# Altium project ADV7611采集卡.PrjPcb
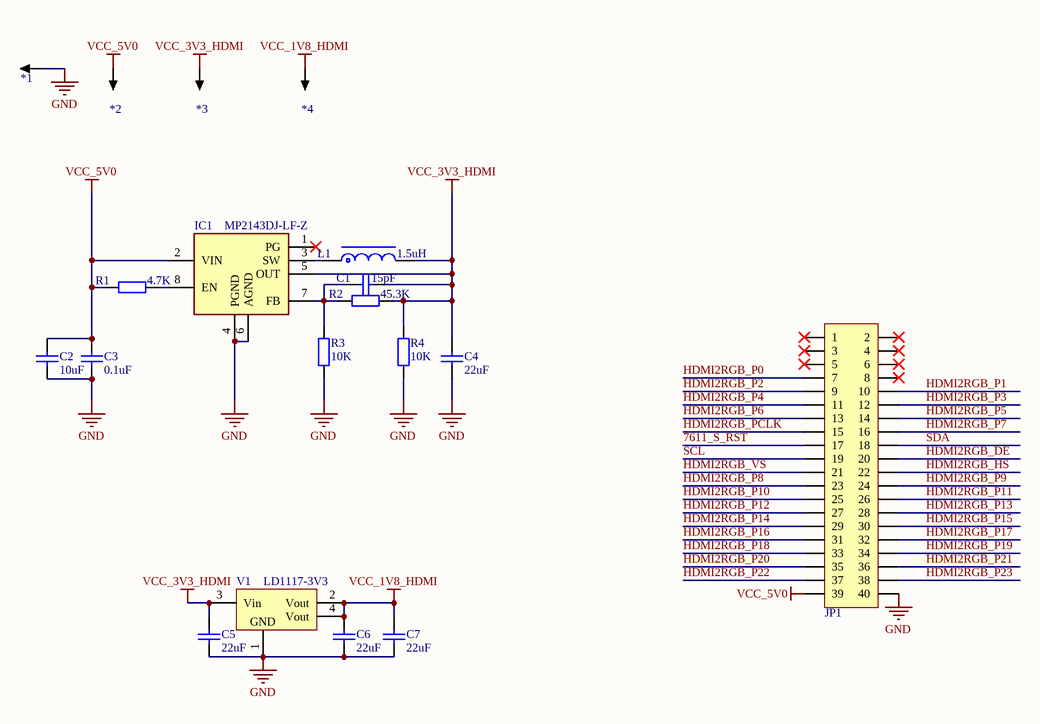
[diagram p0: HAT.SchDoc]
2 sheets, 57 parts. Net scope: global (net labels, ports and power ports of the same name join across sheets).
Board file: ADV7611采集卡.PcbDoc
Sheets:
  HAT.SchDoc
  ADV7611.SchDoc

## Sheet HAT.SchDoc
size A4; DocumentNumber: 2; SheetNumber: 1; SheetTotal: 2

### Parts
*1  CS  [R100]  (value not drawn)
*2  CS  [R100]  (value not drawn)
*3  CS  [R100]  (value not drawn)
*4  CS  [R100]  (value not drawn)
C1  15pF  [C0402_L]
C2  10uF  [C0805_L]
C3  0.1uF  [C0402_L]
C4  22uF  [C0805_L]
C5  22uF  [C0603_L]
C6  22uF  [C0603_L]
C7  22uF  [C0805_L]
IC1  MP2143DJ-LF-Z  [SOP65P280X100-8N]
JP1  Header 2X11  [PHD2.0-LI-2x20P]  (value not drawn)
L1  1.5uH  [NR3010]
R1  4.7K  [R0402_L]
R2  45.3K  [R0402_L]
R3  10K  [R0402_L]
R4  10K  [R0402_L]
V1  LD1117-3V3  [SOT223_L]

### Nets
GND: *1.1 C2.1 C3.1 C4.1 C5.1 C6.1 C7.1 IC1.4(PGND) IC1.6(AGND) JP1.40 R3.1 R4.1 V1.1(GND)
VCC_1V8_HDMI: *4.1 C6.2 C7.2 V1.2(Vout) V1.4(Vout)
VCC_3V3_HDMI: *3.1 C1.1 C4.2 C5.2 IC1.5(OUT) L1.2 R2.1 R4.2 V1.3(Vin)
VCC_5V0: *2.1 C2.2 C3.2 IC1.2(VIN) JP1.39 R1.2
7611_S_RST: JP1.17
HDMI2RGB_DE: JP1.20
HDMI2RGB_HS: JP1.22
HDMI2RGB_P0: JP1.7
HDMI2RGB_P1: JP1.10
HDMI2RGB_P2: JP1.9
HDMI2RGB_P3: JP1.12
HDMI2RGB_P4: JP1.11
HDMI2RGB_P5: JP1.14
HDMI2RGB_P6: JP1.13
HDMI2RGB_P7: JP1.16
HDMI2RGB_P8: JP1.23
HDMI2RGB_P9: JP1.24
HDMI2RGB_P10: JP1.25
HDMI2RGB_P11: JP1.26
HDMI2RGB_P12: JP1.27
HDMI2RGB_P13: JP1.28
HDMI2RGB_P14: JP1.29
HDMI2RGB_P15: JP1.30
HDMI2RGB_P16: JP1.31
HDMI2RGB_P17: JP1.32
HDMI2RGB_P18: JP1.33
HDMI2RGB_P19: JP1.34
HDMI2RGB_P20: JP1.35
HDMI2RGB_P21: JP1.36
HDMI2RGB_P22: JP1.37
HDMI2RGB_P23: JP1.38
HDMI2RGB_PCLK: JP1.15
HDMI2RGB_VS: JP1.21
SCL: JP1.19
SDA: JP1.18
NetC1_2: C1.2 IC1.7(FB) R2.2 R3.2
NetIC1_3: IC1.3(SW) L1.1
NetIC1_8: IC1.8(EN) R1.1

Not connected (* = marked no-connect by the designer): IC1 1(PG)*; JP1 1* 2* 3* 4* 5* 6* 8*

### Library data of the parts
*1-*4 = CS: 探针焊盘; 联系卖家，免费查找封装: 唯一出售店铺网址https://shop463601444.taobao.com; BOM名称: 探针焊盘
C1-C7 = C: 贴片电容; BOM名称: 无极性贴片电容; 联系卖家，免费查找封装: 唯一出售店铺网址https://shop463601444.taobao.com
IC1 = MP2143DJ-LF-Z: Integrated Circuit; Manufacturer_Name: Monolithic Power Systems (MPS); Datasheet Link: https://www.mouser.com/ds/2/277/MP2143_r1.07-371732.pdf; Height: 1mm; Manufacturer_Part_Number: MP2143DJ-LF-Z; Mouser Part Number: 946-MP2143DJLFZ; Mouser Price/Stock: https://www.mouser.co.uk/ProductDetail/Monolithic-Power-Systems-MPS/MP2143DJ-LF-Z?qs=QEkzKklKf2Sh6e0cSbvEyA%3D%3D
JP1 = Header 20X2: 20*2P接插件; 封装库来自淘宝卖家 ID：黄晶宝石: 其他店铺购入均为盗版假冒封装库; BOM名称: 20*2P接插件
L1 = L-NR: 太诱-NR磁胶电感; 0.0_BOM名称: NR磁胶电感; 3.交流分享: Q群514746572,开源更新,欢迎一起交流学习PCB设计; 4.作者声明: 旨为整合最全库集,欢迎转载,禁止商用！-冰凌猫; 5.备注说明: 该库已二次整合过网上各热销库,基本最全,无需重复搜购安装; 1.库作者: 冰凌猫; 2.库版本: v2.0 (2021.03.30)
R1-R4 = R: 贴片电阻; 联系卖家，免费查找封装: 唯一出售店铺网址https://shop463601444.taobao.com; 封装库来自淘宝卖家ID：黄晶宝石: 其他店铺购入均为盗版假冒封装库，请立即申请退款; BOM名称: 贴片电阻
V1 = LD1117: 三端稳压芯片; BOM名称: 稳压芯片; 封装库来自淘宝卖家 ID：黄晶宝石: 其他店铺购入均为盗版，请立即申请退款，本店现金奖励5~20元; 联系卖家 免费查找封装: 唯一出售店铺网址https://shop463601444.taobao.com

## Sheet ADV7611.SchDoc
size A4; DocumentNumber: 2; SheetNumber: 2; SheetTotal: 2
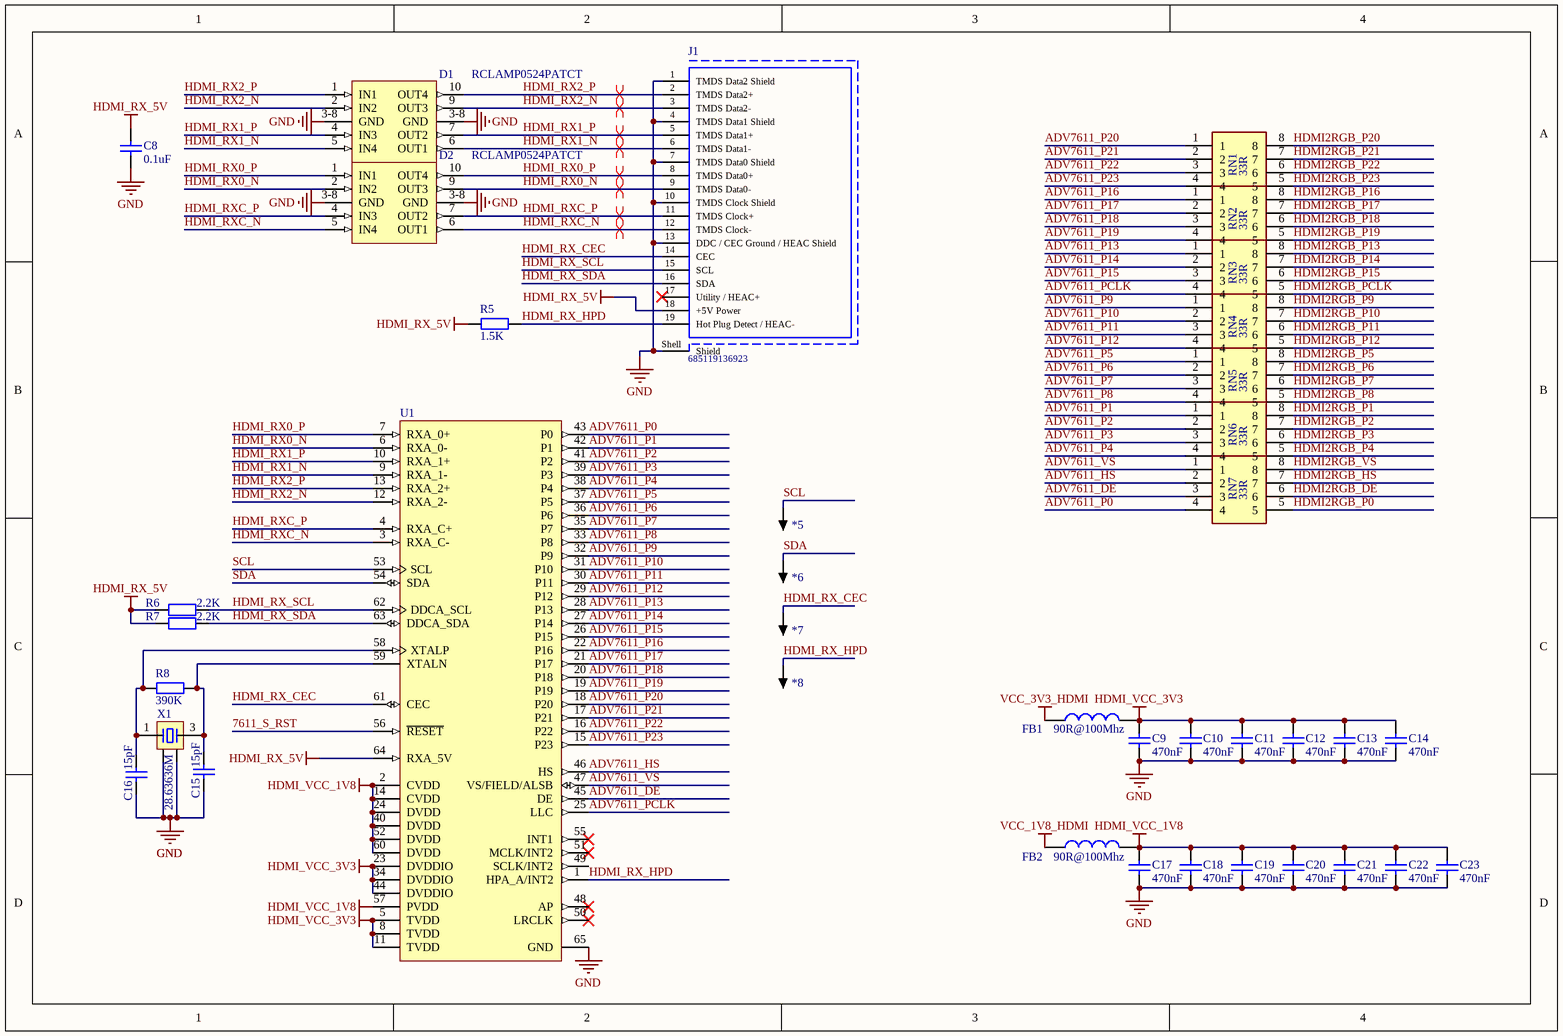
[diagram p1: ADV7611.SchDoc]

### Parts
*5  CS  [R100]  (value not drawn)
*6  CS  [R100]  (value not drawn)
*7  CS  [R100]  (value not drawn)
*8  CS  [R100]  (value not drawn)
C8  0.1uF  [C0402_L]
C9  470nF  [C0402_L]
C10  470nF  [C0402_L]
C11  470nF  [C0402_L]
C12  470nF  [C0402_L]
C13  470nF  [C0402_L]
C14  470nF  [C0402_L]
C15  15pF  [C0402_L]
C16  15pF  [C0402_L]
C17  470nF  [C0402_L]
C18  470nF  [C0402_L]
C19  470nF  [C0402_L]
C20  470nF  [C0402_L]
C21  470nF  [C0402_L]
C22  470nF  [C0402_L]
C23  470nF  [C0402_L]
D1  RCLAMP0524PATCT  [FP-SLP2510P8-MFG]
D2  RCLAMP0524PATCT  [FP-SLP2510P8-MFG]
FB1  90R@100Mhz  [L0402]
FB2  90R@100Mhz  [L0402]
J1  685119136923  [685119136923]
R5  1.5K  [R0402_L]
R6  2.2K  [R0402_L]
R7  2.2K  [R0402_L]
R8  390K  [R0402_L]
RN1  33R  [EXB28V510JX]
RN2  33R  [EXB28V510JX]
RN3  33R  [EXB28V510JX]
RN4  33R  [EXB28V510JX]
RN5  33R  [EXB28V510JX]
RN6  33R  [EXB28V510JX]
RN7  33R  [EXB28V510JX]
U1  (no value)  [ADI-SW-64-2_L]
X1  28.63636M  [OSC 3225-4P]

### Nets
GND: C8.1 C9.1 C10.1 C11.1 C12.1 C13.1 C14.1 C15.2 C16.2 C17.1 C18.1 C19.1 C20.1 C21.1 C22.1 C23.1 D1.3-8(GND) D2.3-8(GND) J1.1(TMDS_Data2_Shield) J1.4(TMDS_Data1_Shield) J1.7(TMDS_Data0_Shield) J1.10(TMDS_Clock_Shield) J1.13(DDC_/_CEC_Ground_/_HEAC_Shield) J1.Shell(Shield) U1.65(GND) X1.2 X1.4
HDMI_RX_5V: C8.2 J1.18(+5V_Power) R5.2 R6.2 R7.2 U1.64(RXA_5V)
HDMI_VCC_1V8: C17.2 C18.2 C19.2 C20.2 C21.2 C22.2 C23.2 FB2.2 U1.2(CVDD) U1.14(CVDD) U1.24(DVDD) U1.40(DVDD) U1.52(DVDD) U1.57(PVDD) U1.60(DVDD)
HDMI_VCC_3V3: C9.2 C10.2 C11.2 C12.2 C13.2 C14.2 FB1.2 U1.5(TVDD) U1.8(TVDD) U1.11(TVDD) U1.23(DVDDIO) U1.34(DVDDIO) U1.44(DVDDIO)
VCC_1V8_HDMI: FB2.1
VCC_3V3_HDMI: FB1.1
7611_S_RST: U1.56(~{RESET})
ADV7611_DE: RN7.3 U1.45(DE)
ADV7611_HS: RN7.2 U1.46(HS)
ADV7611_P0: RN7.4 U1.43(P0)
ADV7611_P1: RN6.1 U1.42(P1)
ADV7611_P2: RN6.2 U1.41(P2)
ADV7611_P3: RN6.3 U1.39(P3)
ADV7611_P4: RN6.4 U1.38(P4)
ADV7611_P5: RN5.1 U1.37(P5)
ADV7611_P6: RN5.2 U1.36(P6)
ADV7611_P7: RN5.3 U1.35(P7)
ADV7611_P8: RN5.4 U1.33(P8)
ADV7611_P9: RN4.1 U1.32(P9)
ADV7611_P10: RN4.2 U1.31(P10)
ADV7611_P11: RN4.3 U1.30(P11)
ADV7611_P12: RN4.4 U1.29(P12)
ADV7611_P13: RN3.1 U1.28(P13)
ADV7611_P14: RN3.2 U1.27(P14)
ADV7611_P15: RN3.3 U1.26(P15)
ADV7611_P16: RN2.1 U1.22(P16)
ADV7611_P17: RN2.2 U1.21(P17)
ADV7611_P18: RN2.3 U1.20(P18)
ADV7611_P19: RN2.4 U1.19(P19)
ADV7611_P20: RN1.1 U1.18(P20)
ADV7611_P21: RN1.2 U1.17(P21)
ADV7611_P22: RN1.3 U1.16(P22)
ADV7611_P23: RN1.4 U1.15(P23)
ADV7611_PCLK: RN3.4 U1.25(LLC)
ADV7611_VS: RN7.1 U1.47(VS/FIELD/ALSB)
HDMI2RGB_DE: RN7.6
HDMI2RGB_HS: RN7.7
HDMI2RGB_P0: RN7.5
HDMI2RGB_P1: RN6.8
HDMI2RGB_P2: RN6.7
HDMI2RGB_P3: RN6.6
HDMI2RGB_P4: RN6.5
HDMI2RGB_P5: RN5.8
HDMI2RGB_P6: RN5.7
HDMI2RGB_P7: RN5.6
HDMI2RGB_P8: RN5.5
HDMI2RGB_P9: RN4.8
HDMI2RGB_P10: RN4.7
HDMI2RGB_P11: RN4.6
HDMI2RGB_P12: RN4.5
HDMI2RGB_P13: RN3.8
HDMI2RGB_P14: RN3.7
HDMI2RGB_P15: RN3.6
HDMI2RGB_P16: RN2.8
HDMI2RGB_P17: RN2.7
HDMI2RGB_P18: RN2.6
HDMI2RGB_P19: RN2.5
HDMI2RGB_P20: RN1.8
HDMI2RGB_P21: RN1.7
HDMI2RGB_P22: RN1.6
HDMI2RGB_P23: RN1.5
HDMI2RGB_PCLK: RN3.5
HDMI2RGB_VS: RN7.8
HDMI_RX0_N: D2.2(IN2) D2.9(OUT3) J1.9(TMDS_Data0-) U1.6(RXA_0-)
HDMI_RX0_P: D2.1(IN1) D2.10(OUT4) J1.8(TMDS_Data0+) U1.7(RXA_0+)
HDMI_RX1_N: D1.5(IN4) D1.6(OUT1) J1.6(TMDS_Data1-) U1.9(RXA_1-)
HDMI_RX1_P: D1.4(IN3) D1.7(OUT2) J1.5(TMDS_Data1+) U1.10(RXA_1+)
HDMI_RX2_N: D1.2(IN2) D1.9(OUT3) J1.3(TMDS_Data2-) U1.12(RXA_2-)
HDMI_RX2_P: D1.1(IN1) D1.10(OUT4) J1.2(TMDS_Data2+) U1.13(RXA_2+)
HDMI_RX_CEC: *7.1 J1.14(CEC) U1.61(CEC)
HDMI_RX_HPD: *8.1 J1.19(Hot_Plug_Detect_/_HEAC-) R5.1 U1.1(HPA_A/INT2)
HDMI_RX_SCL: J1.15(SCL) R6.1 U1.62(DDCA_SCL)
HDMI_RX_SDA: J1.16(SDA) R7.1 U1.63(DDCA_SDA)
HDMI_RXC_N: D2.5(IN4) D2.6(OUT1) J1.12(TMDS_Clock-) U1.3(RXA_C-)
HDMI_RXC_P: D2.4(IN3) D2.7(OUT2) J1.11(TMDS_Clock+) U1.4(RXA_C+)
SCL: *5.1 U1.53(SCL)
SDA: *6.1 U1.54(SDA)
NetC15_1: C15.1 R8.2 U1.59(XTALN) X1.3
NetC16_1: C16.1 R8.1 U1.58(XTALP) X1.1

Not connected (* = marked no-connect by the designer): J1 17(Utility_/_HEAC+)*; U1 48(AP)* 49(SCLK/INT2) 50(LRCLK)* 51(MCLK/INT2)* 55(INT1)*

### Layout directives
differential pair: HDMI_RX0_N, HDMI_RX0_P, HDMI_RX1_N, HDMI_RX1_P, HDMI_RX2_N, HDMI_RX2_P, HDMI_RXC_N, HDMI_RXC_P

### Library data of the parts
*5-*8 = CS: as *1 on sheet HAT; BOM名称: 探针焊盘
C8-C23 = C: as C1 on sheet HAT
D1 D2 = RCLAMP0524PATCT: TVS DIODE 5V 15V SLP2510P8; Number of Unidirectional Channels: 4; Min Breakdown Voltage: 6V; Direction: Unidirectional; Power Line Protection: Yes; Peak Pulse Power: 150W; Leakage Current: 1uA; Capacitance: 0.8pF; Peak Pulse Current: 1A; Series: RailClamp®; Min Operating Temperature: -55°C; Number of Bidirectional Channels: 4; Mount: Surface Mount; Clamping Voltage: 15V; Clamping Voltage-Max: 15V; Max Operating Temperature: 125°C; Working Voltage: 5V; Case/Package: SMD/SMT; Packaging: Tape and Reel; RoHS Compliant: Yes; Reverse Standoff Voltage: 5V; Radiation Hardening: No; Number of Pins: 10; Depth: 1mm; Length: 2.5mm
FB1 FB2 = L: 磁珠; BOM名称: 小功率贴片电感; 联系卖家，免费查找封装: 唯一出售店铺网址https://shop463601444.taobao.com; 封装库来自淘宝卖家ID：黄晶宝石: 其他店铺购入均为盗版假冒封装库，请立即申请退款
J1 = CMP-1502-00171-1: Mini HDMI Type C Receptacle WR-COM, Horizontal, SMT; Manufacturer: Wurth Elektronik; Rated Current: 0.5A; Contact Resistance: 30mOhm; Working Voltage: 40VAC; Orientation: Horizontal; Publisher: WurthElektronik; Package Reference: 685119136923; Mounting Technology: SMT; Packaging: TapeandReel; Manufacturer URL: http://www.we-online.de; Part Number: 685119136923; Datasheet URL: https://katalog.we-online.de/em/datasheet/685119136923.pdf; Connector Type: MiniHDMITypeC; Gender: Receptacle; Operating Temperature: -25to85degC
R5-R8 = R: as R1 on sheet HAT; BOM名称: 贴片电阻
RN1-RN7 = 0804: Resistor Network; Manufacturer_Name: Panasonic; Manufacturer_Part_Number: EXB-28V330JX; Datasheet Link: https://industrial.panasonic.com/cdbs/www-data/pdf/AOC0000/AOC0000C14.pdf; Height: 0mm; Mouser Part Number: 667-EXB-28V330JX; Mouser Price/Stock: https://www.mouser.co.uk/ProductDetail/Panasonic/EXB-28V330JX?qs=oE3VwAv%2FYtn71VsKkW8DQQ%3D%3D; Arrow Part Number: EXB-28V330JX; Arrow Price/Stock: https://www.arrow.com/en/products/exb28v330jx/panasonic?region=nac
U1 = CMP-1517-00002-1: Low Power HDMI Receiver, 165 MHz, 1.71 to 1.89 V, -40 to 85 degC, 64-Pin LQFP_EP (SW-64-2), RoHS, Tray; Manufacturer: Analog Devices; PartNumber: ADV7611BSWZ-P; COUT: 20 pF Max.; VIH: 1.2 V Min.; TMDS Clock Frequency: 165 MHz Max.; CIN: 10 pF Max.; PackageDescription: 64-Pin Low-Profile Quad Flat Package, Body 10 x 10 mm, Pitch 0.5 mm; Packing: Tray; ComponentLink1URL: http://www.analog.com/en/index.html; ComponentLink1Description: Manufacturer URL; PackageVersion: Mar-10; Temperature Range: -40 to 85 degC; PackageReference: SW-64-2; RoHS: TRUE; DatasheetVersion: Rev. D; DVDD: 1.71 to 1.89 V; ComponentLink2URL: http://www.analog.com/static/imported-files/data_sheets/ADV7611.pdf; ComponentLink3Description: Package Specification; ComponentLink2Description: Datasheet; ComponentLink3URL: http://www.analog.com/static/imported-files/packages/PKG_PDF/LQFP_ED(SW)/SW_64_2.pdf; Mounting Technology: Surface Mount
X1 = XTAL-4P: 4脚无源晶振; 联系卖家，免费查找封装: 唯一出售店铺网址https://shop463601444.taobao.com; BOM名称: 4脚无源晶振

## Nets that join several sheets
GND: HAT (13 pins), ADV7611 (27 pins)
VCC_1V8_HDMI: HAT (5 pins), ADV7611 (FB2.1)
VCC_3V3_HDMI: HAT (9 pins), ADV7611 (FB1.1)
7611_S_RST: HAT (JP1.17), ADV7611 (U1.56)
HDMI2RGB_DE: HAT (JP1.20), ADV7611 (RN7.6)
HDMI2RGB_HS: HAT (JP1.22), ADV7611 (RN7.7)
HDMI2RGB_P0: HAT (JP1.7), ADV7611 (RN7.5)
HDMI2RGB_P1: HAT (JP1.10), ADV7611 (RN6.8)
HDMI2RGB_P2: HAT (JP1.9), ADV7611 (RN6.7)
HDMI2RGB_P3: HAT (JP1.12), ADV7611 (RN6.6)
HDMI2RGB_P4: HAT (JP1.11), ADV7611 (RN6.5)
HDMI2RGB_P5: HAT (JP1.14), ADV7611 (RN5.8)
HDMI2RGB_P6: HAT (JP1.13), ADV7611 (RN5.7)
HDMI2RGB_P7: HAT (JP1.16), ADV7611 (RN5.6)
HDMI2RGB_P8: HAT (JP1.23), ADV7611 (RN5.5)
HDMI2RGB_P9: HAT (JP1.24), ADV7611 (RN4.8)
HDMI2RGB_P10: HAT (JP1.25), ADV7611 (RN4.7)
HDMI2RGB_P11: HAT (JP1.26), ADV7611 (RN4.6)
HDMI2RGB_P12: HAT (JP1.27), ADV7611 (RN4.5)
HDMI2RGB_P13: HAT (JP1.28), ADV7611 (RN3.8)
HDMI2RGB_P14: HAT (JP1.29), ADV7611 (RN3.7)
HDMI2RGB_P15: HAT (JP1.30), ADV7611 (RN3.6)
HDMI2RGB_P16: HAT (JP1.31), ADV7611 (RN2.8)
HDMI2RGB_P17: HAT (JP1.32), ADV7611 (RN2.7)
HDMI2RGB_P18: HAT (JP1.33), ADV7611 (RN2.6)
HDMI2RGB_P19: HAT (JP1.34), ADV7611 (RN2.5)
HDMI2RGB_P20: HAT (JP1.35), ADV7611 (RN1.8)
HDMI2RGB_P21: HAT (JP1.36), ADV7611 (RN1.7)
HDMI2RGB_P22: HAT (JP1.37), ADV7611 (RN1.6)
HDMI2RGB_P23: HAT (JP1.38), ADV7611 (RN1.5)
HDMI2RGB_PCLK: HAT (JP1.15), ADV7611 (RN3.5)
HDMI2RGB_VS: HAT (JP1.21), ADV7611 (RN7.8)
SCL: HAT (JP1.19), ADV7611 (*5.1 U1.53)
SDA: HAT (JP1.18), ADV7611 (*6.1 U1.54)